# Altium schematic sheet Power.SchDoc
size Letter
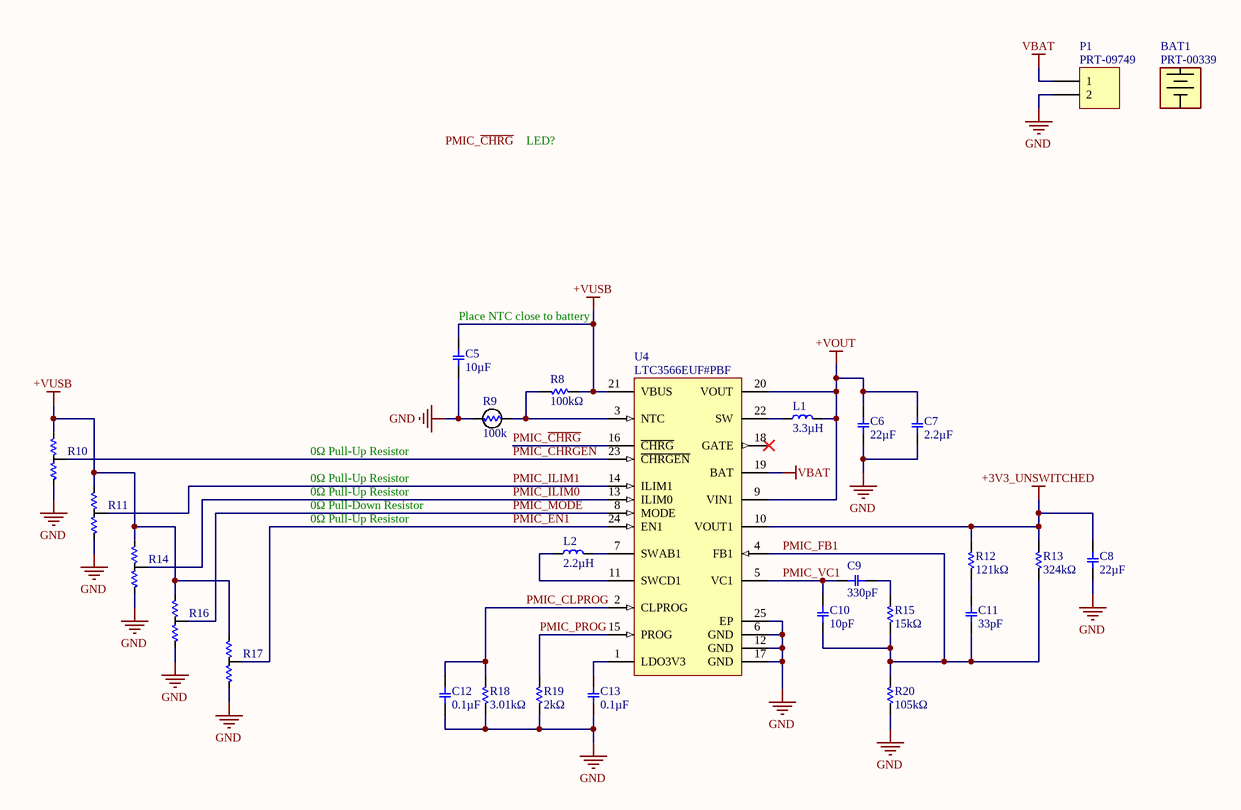
[diagram p0: Power.SchDoc]

## Parts
BAT1  PRT-00339  [LiPo Battery - 1000mA]
C5  10µF  [C0805(2012)_NP_med]
C6  22µF  [C0805(2012)_NP_med]
C7  2.2µF  [C0805(2012)_NP_med]
C8  22µF  [C0805(2012)_NP_med]
C9  330pF  [C0805(2012)_NP_med]
C10  10pF  [C0805(2012)_NP_med]
C11  33pF  [C0805(2012)_NP_med]
C12  0.1µF  [C0805(2012)_NP_med]
C13  0.1µF  [C0805(2012)_NP_med]
L1  Inductance: 3.3µH  [WURTH WE-TPC 4828]  (hidden comment: Wurth 744043003)
L2  Inductance: 2.2µH  [WURTH WE-TPC 4828]  (hidden comment: Wurth 7440430022)
P1  PRT-09749  [SPARKFUN PRT-09749]
R8  100kΩ  [R0805(2012)_med]
R9  Resistance in Ohms @ 25°C: 100k  [R0805(2012)_med]  (hidden comment: Vishay NTCS0805E3104FXT)
R10  0  [R0805(2012)_med_double]  (value not drawn)
R11  0  [R0805(2012)_med_double]  (value not drawn)
R12  121kΩ  [R0805(2012)_med]
R13  324kΩ  [R0805(2012)_med]
R14  0  [R0805(2012)_med_double]  (value not drawn)
R15  15kΩ  [R0805(2012)_med]
R16  0  [R0805(2012)_med_double]  (value not drawn)
R17  0  [R0805(2012)_med_double]  (value not drawn)
R18  3.01kΩ  [R0805(2012)_med]
R19  2kΩ  [R0805(2012)_med]
R20  105kΩ  [R0805(2012)_med]
U4  LTC3566EUF#PBF  [LT-UF-24_N]

## Nets
+3V3_UNSWITCHED: C8.2 R12.1 R13.1 U4.10(VOUT1)
+VOUT: C6.2 C7.2 L1.2 U4.9(VIN1) U4.20(VOUT)
+VUSB: C5.2 R8.2 R10.1 R11.1 R14.1 R16.1 R17.1 U4.21(VBUS)
GND: C5.1 C6.1 C7.1 C8.1 C12.2 C13.2 P1.2 R9.1 R10.3 R11.3 R14.3 R16.3 R17.3 R18.2 R19.2 R20.2 U4.6(GND) U4.12(GND) U4.17(GND) U4.25(EP)
VBAT: P1.1 U4.19(BAT)
PMIC_~{CHRG}: U4.16(~{CHRG})
PMIC_~{CHRGEN}: R10.2 U4.23(~{CHRGEN})
PMIC_CLPROG: C12.1 R18.1 U4.2(CLPROG)
PMIC_EN1: R17.2 U4.24(EN1)
PMIC_FB1: C10.2 C11.1 R13.2 R15.2 R20.1 U4.4(FB1)
PMIC_ILIM0: R14.2 U4.13(ILIM0)
PMIC_ILIM1: R11.2 U4.14(ILIM1)
PMIC_MODE: R16.2 U4.8(MODE)
PMIC_PROG: R19.1 U4.15(PROG)
PMIC_VC1: C9.1 C10.1 U4.5(VC1)
NetC9_2: C9.2 R15.1
NetC11_2: C11.2 R12.2
NetC13_1: C13.1 U4.1(LDO3V3)
NetL1_1: L1.1 U4.22(SW)
NetL2_1: L2.1 U4.11(SWCD1)
NetL2_2: L2.2 U4.7(SWAB1)
NetR8_1: R8.1 R9.2 U4.3(NTC)

Not connected (* = marked no-connect by the designer): U4 18(GATE)*

## Notes on the sheet
- LED?
- (near C5) Place NTC close to battery
- 0Ω Pull-Up Resistor
- 0Ω Pull-Down Resistor
- Labels drawn without touching a wire or pin: PMIC_~{CHRG}

## Library data of the parts
BAT1 = PRT-00339: Polymer Lithium Ion Battery - 1000mAh
C5-C13 = CPN_SMT: SMT Capacitor; Tolerance: X7R; Rating: 16v
  C5: Value: 10µF
  C6 C8: Value: 22µF
  C7: Value: 2.2µF
  C9: Value: 330pF
  C10: Value: 10pF
  C11: Value: 33pF
  C12 C13: Value: 0.1µF
L1 = Wurth 744043003: FIXED IND 3.3UH 2.15A 35 MOHM; Manufacturer: Wurth Electronics Inc; Type: Wirewound; Material - Core: Ferrite; Tolerance: ±30%; Current - Saturation: 1.8A; Shielding: Shielded; DC Resistance (DCR): 35 mOhm Max; Frequency - Self Resonant: 80MHz; Frequency - Test: 100kHz; Supplier 1: Digi-Key; Manufacturer Part Number: 744043003; RoHS: RoHS Compliant; Category: Inductors, Coils, Chokes; Stock 1: 3734; Pricing 1: 1=1.63, 10=1.55, 50=1.4726, 100=1.3563, 250=1.27876 (USD); Packaging: Cut Tape (CT); Current Rating: 2.15A; Q @ Freq: -; Ratings: -; Operating Temperature: -40°C ~ 125°C; Mounting Type: Surface Mount; Package / Case: 1919 (4848 Metric); Size / Dimension: 0.189" L x 0.189" W (4.80mm x 4.80mm); Height - Seated (Max): 0.118" (3.00mm); ComponentLink1URL: http://katalog.we-online.de/pbs/datasheet/744043003.pdf; ComponentLink1Description: http://katalog.we-online.de/pbs/datasheet/744043003.pdf; Supplier Part Number 1: 732-1097-1-ND
L2 = Wurth 7440430022: FIXED IND 2.2UH 2.5A 28 MOHM SMD; Manufacturer: Wurth Electronics Inc; Type: Wirewound; Material - Core: Ferrite; Tolerance: ±30%; Current - Saturation: 2.35A; Shielding: Shielded; DC Resistance (DCR): 28 mOhm Max; Frequency - Self Resonant: 100MHz; Frequency - Test: 100kHz; Supplier 1: Digi-Key; Manufacturer Part Number: 7440430022; RoHS: RoHS Compliant; Category: Inductors, Coils, Chokes; Stock 1: 12343; Pricing 1: 1=1.63, 10=1.55, 50=1.4726, 100=1.3563, 250=1.27876 (USD); Packaging: Cut Tape (CT); Current Rating: 2.5A; Q @ Freq: -; Ratings: -; Operating Temperature: -40°C ~ 125°C; Mounting Type: Surface Mount; Package / Case: 1919 (4848 Metric); Size / Dimension: 0.189" L x 0.189" W (4.80mm x 4.80mm); Height - Seated (Max): 0.118" (3.00mm); ComponentLink1URL: http://katalog.we-online.de/pbs/datasheet/7440430022.pdf; ComponentLink1Description: http://katalog.we-online.de/pbs/datasheet/7440430022.pdf; Supplier Part Number 1: 732-1095-1-ND
P1 = Header 2: Header, 2-Pin
R8 R12 R13 R15 R18-R20 = RES_SMT: SMT resistor; Tolerance: 1%
  R8: Value: 100kΩ
  R12: Value: 121kΩ
  R13: Value: 324kΩ
  R15: Value: 15kΩ
  R18: Value: 3.01kΩ
  R19: Value: 2kΩ
  R20: Value: 105kΩ
R9 = Vishay NTCS0805E3104FXT: THERMISTOR NTC 100K OHM 1% 0805; Manufacturer: Vishay BC Components; B25/85: 4100K; Power - Max: 210mW; Supplier 1: Digi-Key; Manufacturer Part Number: NTCS0805E3104FXT; RoHS: RoHS Compliant; Category: Sensors, Transducers; Stock 1: 17485; Pricing 1: 1=0.6, 10=0.409, 50=0.385, 100=0.3429, 250=0.33684, 500=0.3188, 1000=0.30677 (USD); Packaging: Cut Tape (CT); Resistance Tolerance: ±1%; B Value Tolerance: ±1%; B0/50: -; B25/50: -; B25/75: -; B25/100: -; Operating Temperature: -40°C ~ 150°C; Length - Lead Wire: -; Mounting Type: Surface Mount; Package / Case: 0805 (2012 Metric); ComponentLink1URL: http://www.vishay.com/docs/29044/ntcs0805e3t.pdf; ComponentLink1Description: http://www.vishay.com/docs/29044/ntcs0805e3t.pdf; Supplier Part Number 1: BC2562CT-ND
R10 R11 R14 R16 R17 = RES_SMT_NONPOP: SMT resistor; Tolerance: 1%; Value: 0
U4 = LTC3566EUF#PBF: High Efficiency USB Power Manager Plus 1 A Buck-Boost Converter, 4.35 to 5.5 V Vin, 24-pin QFN (UF-24), -40 to 85 degC, Pb-Free; Manufacturer: Linear Technology; Number of Cells: 1; Vin Max(V): 5.5; Vin Min(V): 4.35; DatasheetVersion: Rev. B; PackageVersion: Rev. B, 02/2012; PackageReference: UF24; PackageDescription: 24-Pin Plastic QFN, Body 4 x 4 mm, Pitch 0.5 mm; Supplier 1: Digi-Key; Supplier Part Number 1: LTC3566EUF#PBF-ND; Supplier 2: Farnell; Supplier Part Number 2: 1628881; Supplier 3: Newark; Supplier Part Number 3: 95M6504; Number of Outputs: 1; RoHS: TRUE; Mounting Technology: Surface Mount; Code_JEDEC: MO-220; PartNumber: LTC3566EUF#PBF; ComponentLink1Description: Manufacturer URL; ComponentLink1URL: http://www.linear.com/; ComponentLink2Description: Datasheet; ComponentLink2URL: http://cds.linear.com/docs/en/datasheet/3566fb.pdf; ComponentLink3Description: Package Specification; ComponentLink3URL: http://cds.linear.com/docs/en/packaging/%28UF24%29%20QFN%2005-08-1697%20Rev%20B.pdf